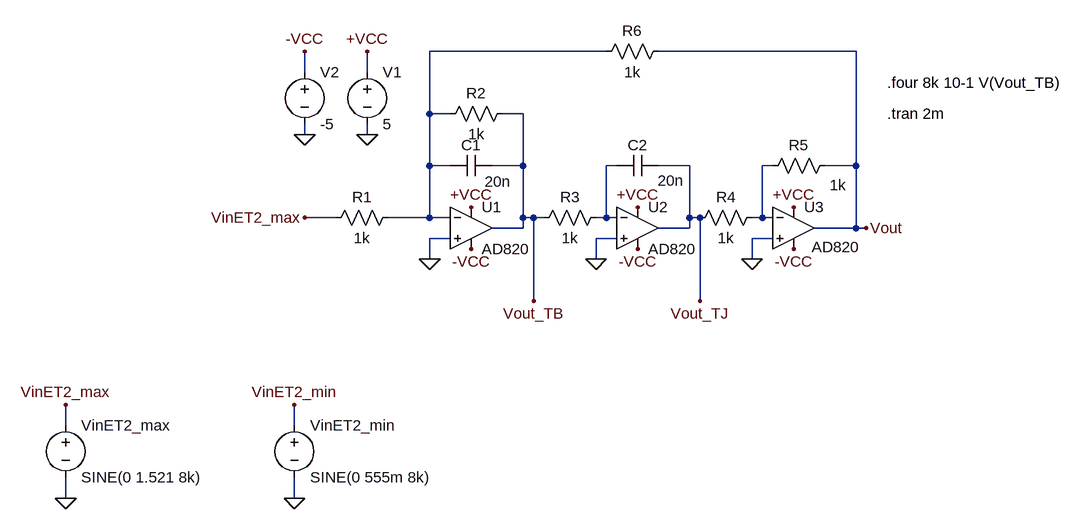
[diagram p0: schematic THD2.asc]
THD2.asc, the LTspice schematic file:
Version 4.1
SHEET 1 1052 740
WIRE 320 32 48 32
WIRE 704 32 400 32
WIRE -144 64 -144 32
WIRE -48 64 -48 32
WIRE 48 128 48 32
WIRE 80 128 48 128
WIRE 192 128 160 128
WIRE -144 160 -144 144
WIRE -48 160 -48 144
WIRE 48 208 48 128
WIRE 80 208 48 208
WIRE 192 208 192 128
WIRE 192 208 144 208
WIRE 336 208 320 208
WIRE 448 208 400 208
WIRE 576 208 560 208
WIRE 704 208 704 32
WIRE 704 208 656 208
WIRE -96 288 -144 288
WIRE 48 288 48 208
WIRE 48 288 -16 288
WIRE 80 288 48 288
WIRE 192 288 192 208
WIRE 208 288 192 288
WIRE 224 288 208 288
WIRE 320 288 320 208
WIRE 320 288 304 288
WIRE 336 288 320 288
WIRE 448 288 448 208
WIRE 464 288 448 288
WIRE 560 288 560 208
WIRE 560 288 544 288
WIRE 576 288 560 288
WIRE 192 304 192 288
WIRE 192 304 144 304
WIRE 448 304 448 288
WIRE 448 304 400 304
WIRE 704 304 704 208
WIRE 704 304 640 304
WIRE 720 304 704 304
WIRE 80 320 48 320
WIRE 336 320 304 320
WIRE 576 320 544 320
WIRE 48 352 48 320
WIRE 304 352 304 320
WIRE 544 352 544 320
WIRE 208 416 208 288
WIRE 464 416 464 288
WIRE -512 608 -512 576
WIRE -160 608 -160 576
WIRE -512 720 -512 688
WIRE -160 720 -160 688
FLAG 48 352 0
FLAG 304 352 0
FLAG 544 352 0
FLAG -144 160 0
FLAG -48 160 0
FLAG -48 32 +VCC
FLAG 112 272 +VCC
FLAG 368 272 +VCC
FLAG 608 272 +VCC
FLAG -144 32 -VCC
FLAG 112 336 -VCC
FLAG 368 336 -VCC
FLAG 608 336 -VCC
FLAG -512 720 0
FLAG 208 416 Vout_TB
FLAG 464 416 Vout_TJ
FLAG 720 304 Vout
FLAG -160 720 0
FLAG -512 576 VinET2_max
FLAG -160 576 VinET2_min
FLAG -144 288 VinET2_max
SYMBOL OpAmps\\AD820 112 240 R0
SYMATTR InstName U1
SYMBOL OpAmps\\AD820 368 240 R0
SYMATTR InstName U2
SYMBOL OpAmps\\AD820 608 240 R0
WINDOW 3 28 93 Left 2
SYMATTR InstName U3
SYMBOL res 0 272 R90
WINDOW 0 0 56 VBottom 2
WINDOW 3 32 56 VTop 2
SYMATTR InstName R1
SYMATTR Value 1k
SYMBOL cap 144 192 R90
WINDOW 0 0 32 VBottom 2
WINDOW 3 25 -9 VTop 2
SYMATTR InstName C1
SYMATTR Value 20n
SYMBOL res 176 112 R90
WINDOW 0 0 56 VBottom 2
WINDOW 3 32 56 VTop 2
SYMATTR InstName R2
SYMATTR Value 1k
SYMBOL res 320 272 R90
WINDOW 0 0 56 VBottom 2
WINDOW 3 32 56 VTop 2
SYMATTR InstName R3
SYMATTR Value 1k
SYMBOL cap 400 192 R90
WINDOW 0 0 32 VBottom 2
WINDOW 3 23 -19 VTop 2
SYMATTR InstName C2
SYMATTR Value 20n
SYMBOL res 560 272 R90
WINDOW 0 0 56 VBottom 2
WINDOW 3 32 56 VTop 2
SYMATTR InstName R4
SYMATTR Value 1k
SYMBOL res 672 192 R90
WINDOW 0 0 56 VBottom 2
WINDOW 3 30 -4 VTop 2
SYMATTR InstName R5
SYMATTR Value 1k
SYMBOL res 416 16 R90
WINDOW 0 0 56 VBottom 2
WINDOW 3 32 56 VTop 2
SYMATTR InstName R6
SYMATTR Value 1k
SYMBOL voltage -48 48 R0
SYMATTR InstName V1
SYMATTR Value 5
SYMBOL voltage -144 48 R0
SYMATTR InstName V2
SYMATTR Value -5
SYMBOL voltage -512 592 R0
WINDOW 123 24 124 Left 2
WINDOW 39 0 0 Left 0
SYMATTR InstName VinET2_max
SYMATTR Value SINE(0 1.521 8k)
SYMBOL voltage -160 592 R0
WINDOW 123 24 124 Left 2
WINDOW 39 0 0 Left 0
SYMATTR InstName VinET2_min
SYMATTR Value SINE(0 555m 8k)
TEXT 752 80 Left 2 !.four 8k 10-1 V(Vout_TB)
TEXT 752 128 Left 2 !.tran 2m

The netlist it stands for:
* THD2.asc
X§U1 0 N001 +VCC -VCC Vout_TB AD820  ; pins In+ In- V+ V- OUT
X§U2 0 N002 +VCC -VCC Vout_TJ AD820  ; pins In+ In- V+ V- OUT
X§U3 0 N003 +VCC -VCC Vout AD820  ; pins In+ In- V+ V- OUT
R1 N001 VinET2_max 1k
C1 Vout_TB N001 20n
R2 Vout_TB N001 1k
R3 N002 Vout_TB 1k
C2 Vout_TJ N002 20n
R4 N003 Vout_TJ 1k
R5 Vout N003 1k
R6 Vout N001 1k
V1 +VCC 0 5
V2 -VCC 0 -5
VinET2_max VinET2_max 0 SINE(0 1.521 8k)
VinET2_min VinET2_min 0 SINE(0 555m 8k)
.four 8k 10-1 V(Vout_TB)
.tran 2m
.backanno
.end